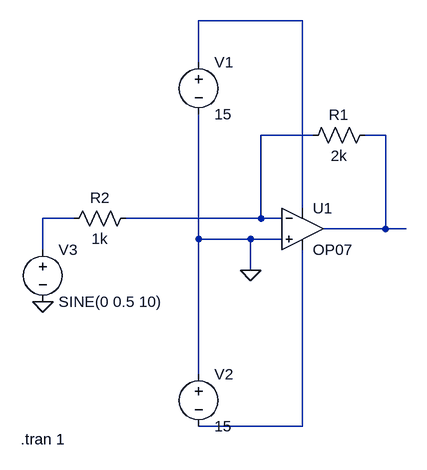
[diagram p0: schematic InvertingAmplifier.asc]
InvertingAmplifier.asc, the LTspice schematic file:
Version 4
SHEET 1 880 680
WIRE 224 -160 64 -160
WIRE 64 -96 64 -160
WIRE 240 16 160 16
WIRE 352 16 320 16
WIRE 224 128 224 -160
WIRE -128 144 -176 144
WIRE 160 144 160 16
WIRE 160 144 -48 144
WIRE 192 144 160 144
WIRE 352 160 352 16
WIRE 352 160 256 160
WIRE 384 160 352 160
WIRE 64 176 64 -16
WIRE 144 176 64 176
WIRE 192 176 144 176
WIRE -176 192 -176 144
WIRE 144 224 144 176
WIRE 64 384 64 176
WIRE 224 464 224 192
WIRE 224 464 64 464
FLAG 144 224 0
FLAG -176 272 0
SYMBOL OpAmps\\OP07 224 96 R0
SYMATTR InstName U1
SYMBOL voltage 64 -112 R0
WINDOW 123 0 0 Left 0
WINDOW 39 0 0 Left 0
SYMATTR InstName V1
SYMATTR Value 15
SYMBOL voltage 64 368 R0
WINDOW 123 0 0 Left 0
WINDOW 39 0 0 Left 0
SYMATTR InstName V2
SYMATTR Value 15
SYMBOL res 336 0 R90
WINDOW 0 0 56 VBottom 2
WINDOW 3 32 56 VTop 2
SYMATTR InstName R1
SYMATTR Value 2k
SYMBOL res -32 128 R90
WINDOW 0 0 56 VBottom 2
WINDOW 3 32 56 VTop 2
SYMATTR InstName R2
SYMATTR Value 1k
SYMBOL voltage -176 176 R0
WINDOW 123 0 0 Left 0
WINDOW 39 0 0 Left 0
SYMATTR InstName V3
SYMATTR Value SINE(0 0.5 10)
TEXT -210 484 Left 2 !.tran 1

The netlist it stands for:
* InvertingAmplifier.asc
XU1 0 N002 N001 N005 N003 LT1001  ; OP07, pins In+ In- V+ V- OUT
V1 N001 0 15
V2 0 N005 15
R1 N003 N002 2k
R2 N002 N004 1k
V3 N004 0 SINE(0 0.5 10)
.tran 1
.lib LTC.lib
.backanno
.end